# EAGLE design top (EAGLE 9.6.2)
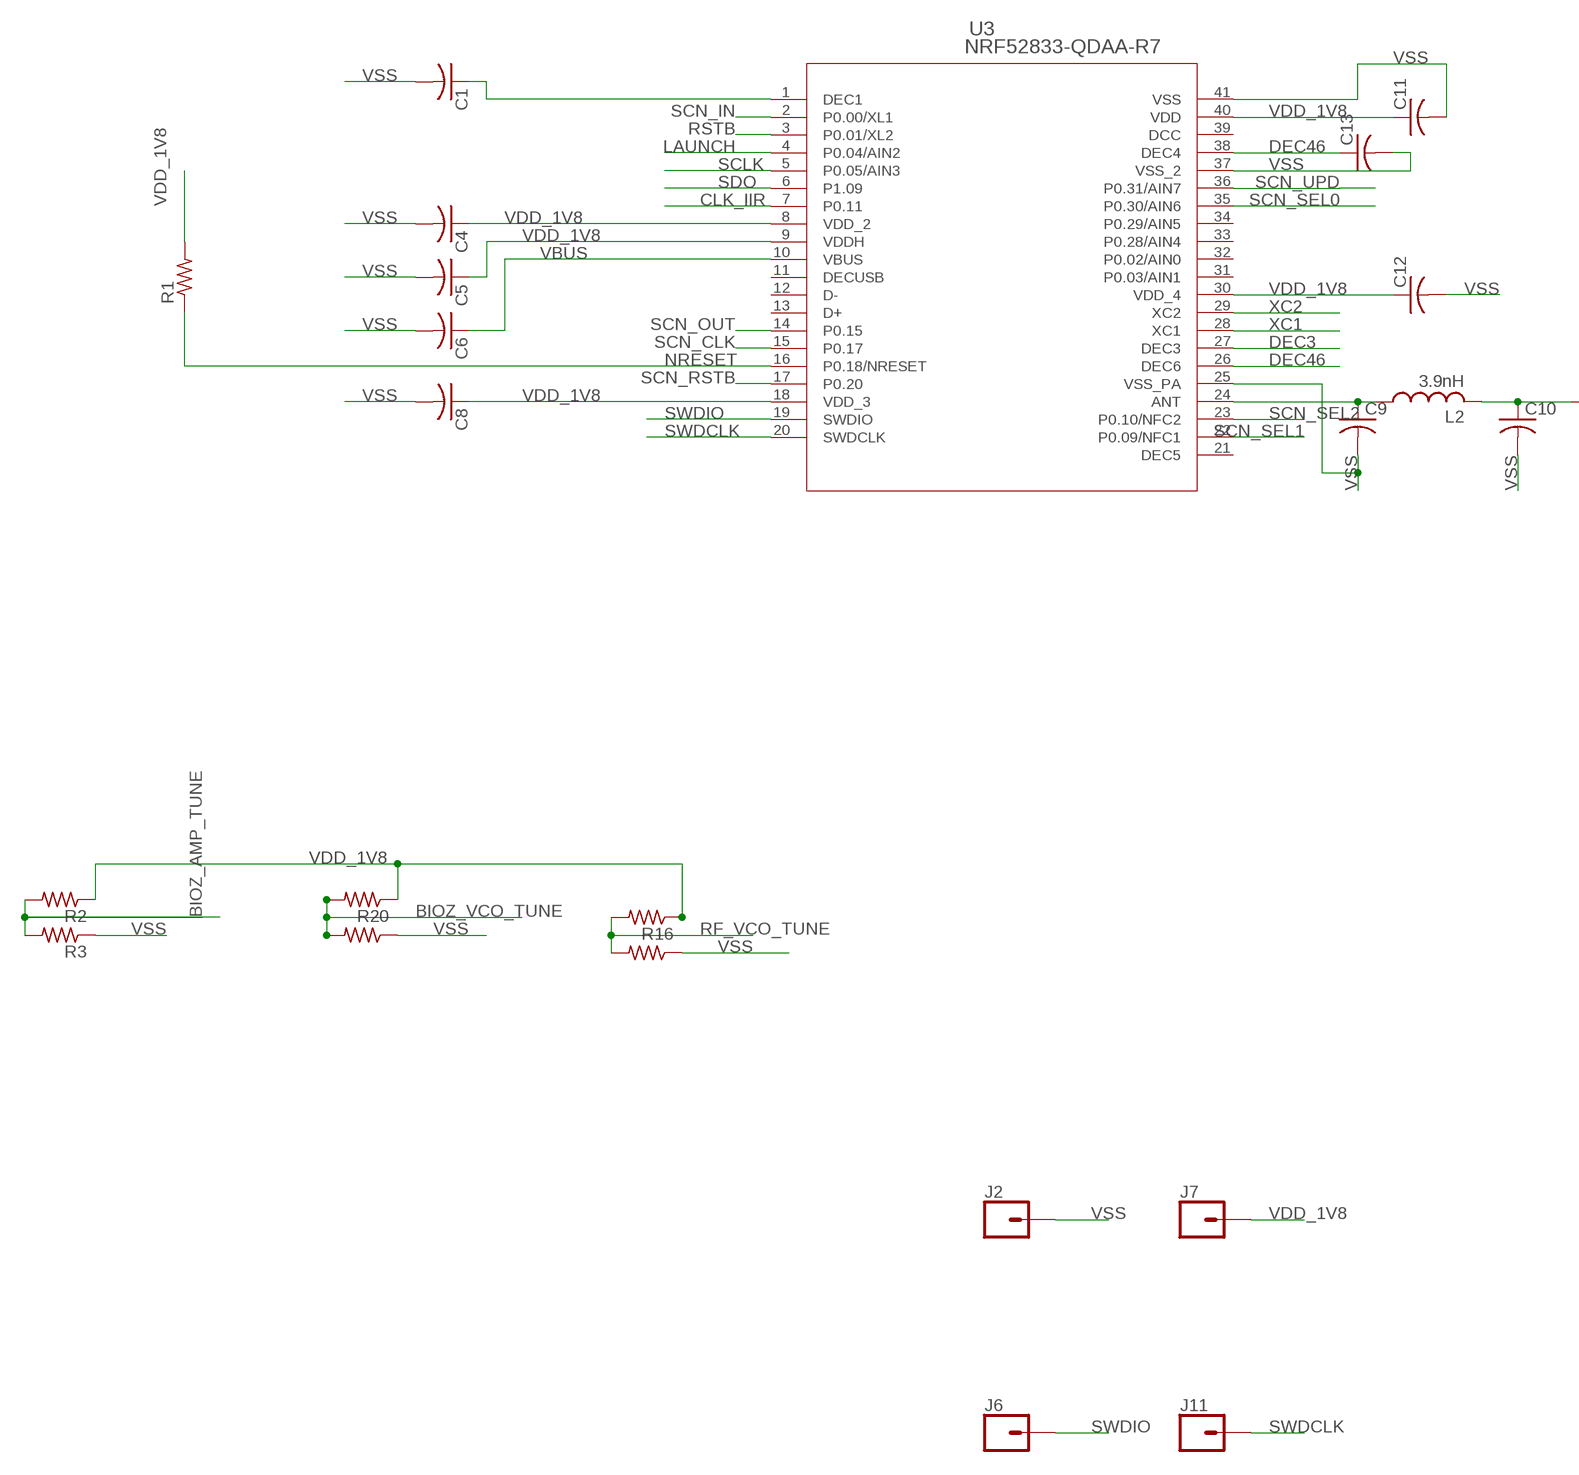
[diagram p0: schematic, sheet 1, part 1 of 2]
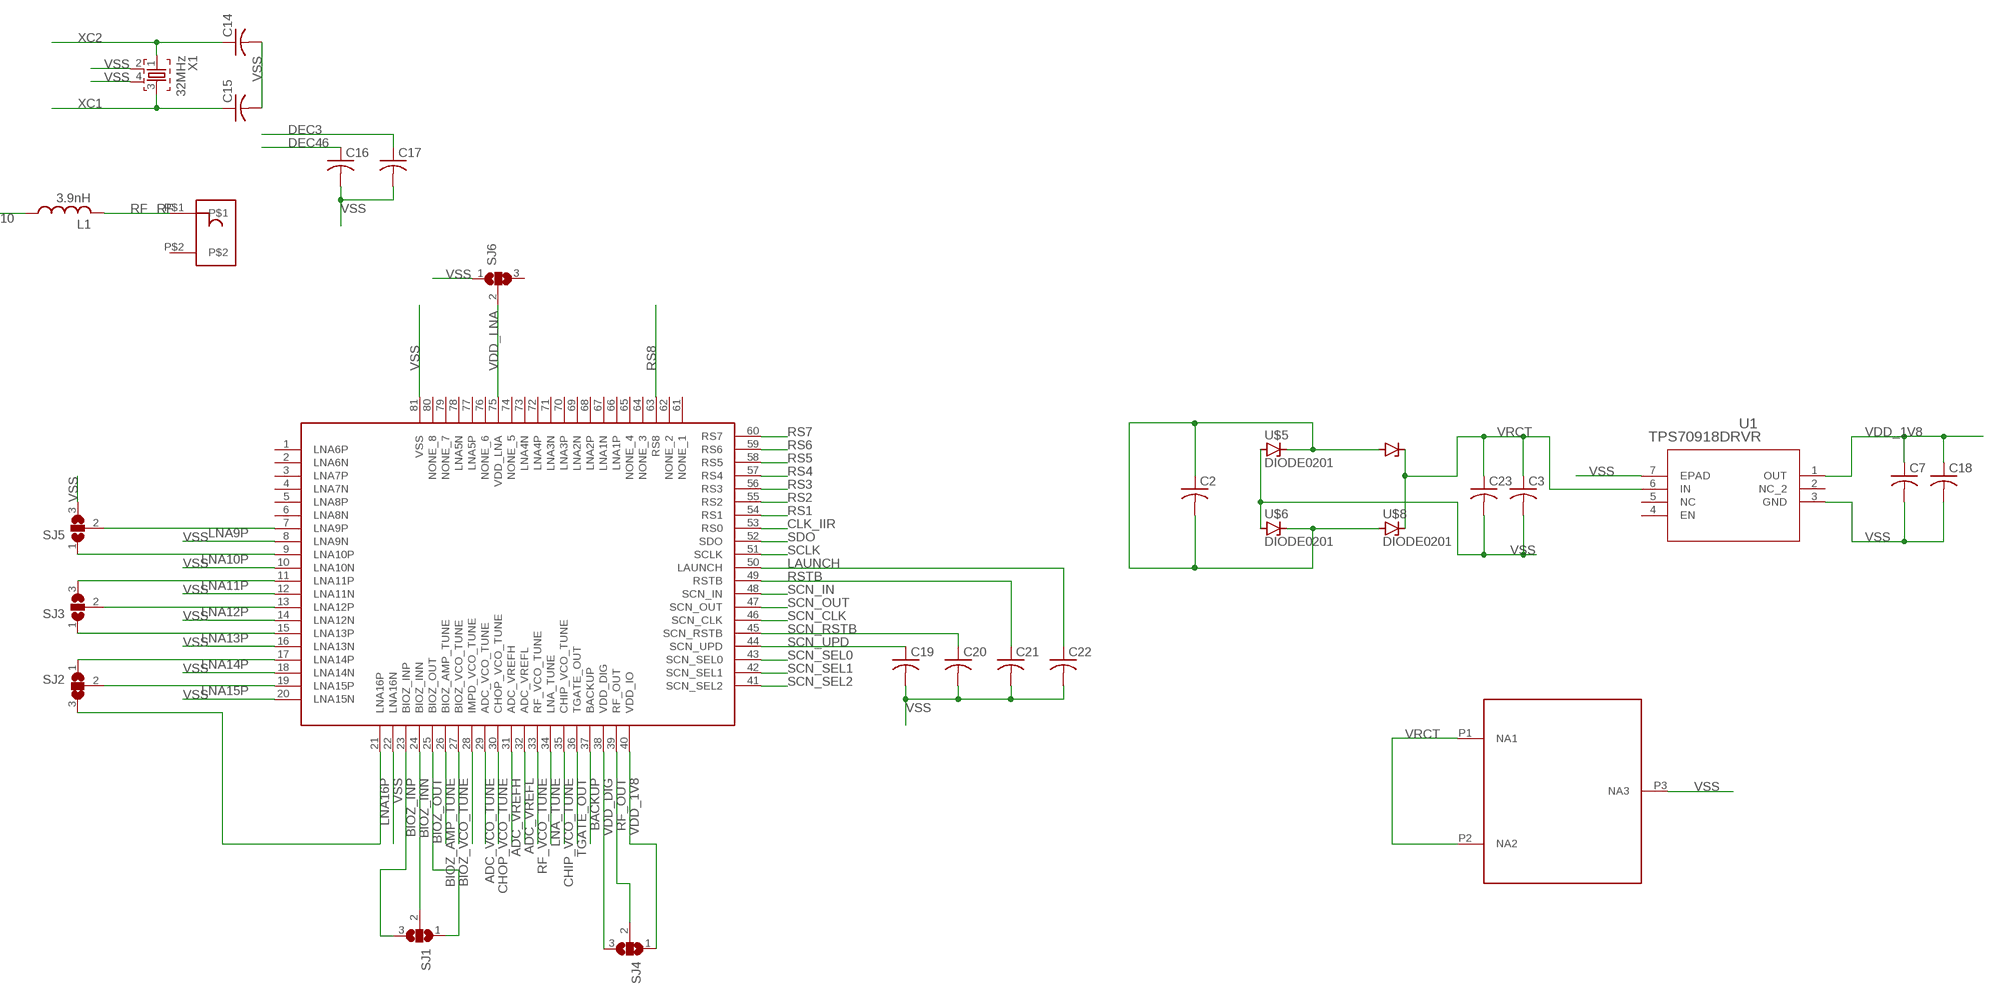
[diagram p1: schematic, sheet 1, part 2 of 2]

## Parts
C1  C-USC0201  [C0201]
C2  C-USC0201  [C0201]
C3  C-USC0402  [C0402]
C4  C-USC0201  [C0201]
C5  C-USC0201  [C0201]
C6  C-USC0201  [C0201]
C7  C-USC1210  [C1210]
C8  C-USC0201  [C0201]
C9  C-USC0201  [C0201]
C10  C-USC0201  [C0201]
C11  C-USC0201  [C0201]
C12  C-USC0201  [C0201]
C13  C-USC0201  [C0201]
C14  C-USC0201  [C0201]
C15  C-USC0201  [C0201]
C16  C-USC0201  [C0201]
C17  C-USC0201  [C0201]
C18  C-USC0402  [C0402]
C19  C-USC0201  [C0201]
C20  C-USC0201  [C0201]
C21  C-USC0201  [C0201]
C22  C-USC0201  [C0201]
C23  C-USC1210  [C1210]
J2  CONN_01  [1X01]
J6  CONN_01  [1X01]
J7  CONN_01  [1X01]
J11  CONN_01  [1X01]
L1  3.9nH  INDUCTOR_0402_N  [RESC0402_N]
L2  3.9nH  INDUCTOR_0402_N  [RESC0402_N]
R1  R-US_R0402  [R0402]
R2  R-US_R0201  [R0201]
R3  R-US_R0201  [R0201]
R16  R-US_R0201  [R0201]
R17  R-US_R0201  [R0201]
R20  R-US_R0201  [R0201]
R22  R-US_R0201  [R0201]
SJ1  SJ2W  [SJ_2]
SJ2  SJ2W  [SJ_2]
SJ3  SJ2W  [SJ_2]
SJ4  SJ2W  [SJ_2]
SJ5  SJ2W  [SJ_2]
SJ6  SJ2W  [SJ_2]
U1  TPS70918DRVR  [DRV6_1P6X1_TEX]
U3  NRF52833-QDAA-R7  [QFN40_5X5_DQ_NOR]
U$1  CHIP_QFN  [QFN50P1200X1200X80-81T900N]
U$3  3030TR  [3030TR]
U$4  AMCA31  [AMCA31]
U$5  DIODE0201  [C0201]
U$6  DIODE0201  [C0201]
U$7  DIODE0201  [C0201]
U$8  DIODE0201  [C0201]
X1  32MHz  XTAL_32MHZ  [BT-XTAL_2016_N]

## Nets
ADC_VCO_TUNE: U$1.29(ADC_VCO_TUNE)
ADC_VREFH: U$1.31(ADC_VREFH)
ADC_VREFL: U$1.32(ADC_VREFL)
BACKUP: U$1.37(BACKUP)
BIOZ_AMP_TUNE: R2.2 R3.2 U$1.26(BIOZ_AMP_TUNE)
BIOZ_INN: SJ1.2 U$1.24(BIOZ_INN)
BIOZ_INP: SJ1.3 U$1.23(BIOZ_INP)
BIOZ_OUT: SJ1.1 U$1.25(BIOZ_OUT)
BIOZ_VCO_TUNE: R20.2 R22.2 U$1.27(BIOZ_VCO_TUNE)
CHIP_VCO_TUNE: U$1.35(CHIP_VCO_TUNE)
CHOP_VCO_TUNE: U$1.30(CHOP_VCO_TUNE)
CLK_IIR: U3.7(P0.11) U$1.53(RS0)
DEC3: C17.1 U3.27(DEC3)
DEC46: C13.1 C16.1 U3.26(DEC6) U3.38(DEC4)
LAUNCH: C22.1 U3.4(P0.04/AIN2) U$1.50(LAUNCH)
LNA9P: SJ5.2 U$1.7(LNA9P)
LNA10P: SJ5.1 U$1.9(LNA10P)
LNA11P: SJ3.3 U$1.11(LNA11P)
LNA12P: SJ3.2 U$1.13(LNA12P)
LNA13P: SJ3.1 U$1.15(LNA13P)
LNA14P: SJ2.1 U$1.17(LNA14P)
LNA15P: SJ2.2 U$1.19(LNA15P)
LNA16P: SJ2.3 U$1.21(LNA16P)
LNA_TUNE: U$1.34(LNA_TUNE)
N$2: C1.1 U3.1(DEC1)
N$3: U$1.28(IMPD_VCO_TUNE)
N$4: C9.1 L2.1 U3.24(ANT)
N$5: C10.1 L1.1 L2.2
N$7: C2.1 C2.2 U$5.2(C) U$6.2(C) U$7.1(A) U$8.1(A)
NRESET: R1.1 U3.16(P0.18/NRESET)
RF: L1.2 U$4.P$1
RF_OUT: SJ4.2 U$1.39(RF_OUT)
RF_VCO_TUNE: R16.2 R17.2 U$1.33(RF_VCO_TUNE)
RS1: U$1.54(RS1)
RS2: U$1.55(RS2)
RS3: U$1.56(RS3)
RS4: U$1.57(RS4)
RS5: U$1.58(RS5)
RS6: U$1.59(RS6)
RS7: U$1.60(RS7)
RS8: U$1.63(RS8)
RSTB: C21.1 U3.3(P0.01/XL2) U$1.49(RSTB)
SCLK: U3.5(P0.05/AIN3) U$1.51(SCLK)
SCN_CLK: U3.15(P0.17) U$1.46(SCN_CLK)
SCN_IN: U3.2(P0.00/XL1) U$1.48(SCN_IN)
SCN_OUT: U3.14(P0.15) U$1.47(SCN_OUT)
SCN_RSTB: C20.1 U3.17(P0.20) U$1.45(SCN_RSTB)
SCN_SEL0: U3.35(P0.30/AIN6) U$1.43(SCN_SEL0)
SCN_SEL1: U3.22(P0.09/NFC1) U$1.42(SCN_SEL1)
SCN_SEL2: U3.23(P0.10/NFC2) U$1.41(SCN_SEL2)
SCN_UPD: C19.1 U3.36(P0.31/AIN7) U$1.44(SCN_UPD)
SDO: U3.6(P1.09) U$1.52(SDO)
SWDCLK: J11.1 U3.20(SWDCLK)
SWDIO: J6.1 U3.19(SWDIO)
TGATE_OUT: U$1.36(TGATE_OUT)
VBUS: C6.1 U3.10(VBUS)
VDD_1V8: C4.1 C5.1 C7.1 C8.1 C11.1 C12.1 C18.1 J7.1 R1.2 R2.1 R16.1 R20.1 SJ4.1 U1.1(OUT) U3.8(VDD_2) U3.9(VDDH) U3.18(VDD_3) U3.30(VDD_4) U3.40(VDD) U$1.40(VDD_IO)
VDD_DIG: SJ4.3 U$1.38(VDD_DIG)
VDD_LNA: SJ6.2 U$1.75(VDD_LNA)
VRCT: C3.1 C23.1 U1.6(IN) U$3.P1(NA1) U$3.P2(NA2) U$7.2(C) U$8.2(C)
VSS: C1.2 C3.2 C4.2 C5.2 C6.2 C7.2 C8.2 C9.2 C10.2 C11.2 C12.2 C13.2 C14.2 C15.2 C16.2 C17.2 C18.2 C19.2 C20.2 C21.2 C22.2 C23.2 J2.1 R3.1 R17.1 R22.1 SJ5.3 SJ6.1 U1.3(GND) U1.7(EPAD) U3.25(VSS_PA) U3.37(VSS_2) U3.41(VSS) U$1.8(LNA9N) U$1.10(LNA10N) U$1.12(LNA11N) U$1.14(LNA12N) U$1.16(LNA13N) U$1.18(LNA14N) U$1.20(LNA15N) U$1.22(LNA16N) U$1.81(VSS) U$3.P3(NA3) U$5.1(A) U$6.1(A) X1.2 X1.4
XC1: C15.1 U3.28(XC1) X1.3
XC2: C14.1 U3.29(XC2) X1.1
Unconnected: SJ6.3 U1.2(NC_2) U1.4(EN) U1.5(NC) U3.12(D-) U3.13(D+) U3.31(P0.03/AIN1) U3.32(P0.02/AIN0) U3.33(P0.28/AIN4) U3.34(P0.29/AIN5) U$1.1(LNA6P) U$1.2(LNA6N) U$1.3(LNA7P) U$1.4(LNA7N) U$1.5(LNA8P) U$1.6(LNA8N) U$1.61(NONE_1) U$1.62(NONE_2) U$1.64(NONE_3) U$1.65(NONE_4) U$1.66(LNA1P) U$1.67(LNA1N) U$1.68(LNA2P) U$1.69(LNA2N) U$1.70(LNA3P) U$1.71(LNA3N) U$1.72(LNA4P) U$1.73(LNA4N) U$1.74(NONE_5) U$1.76(NONE_6) U$1.77(LNA5P) U$1.78(LNA5N) U$1.79(NONE_7) U$1.80(NONE_8) U$4.P$2

## Power pins joined to a net without a drawn wire
DCC: U3.39(DCC)
DEC5: U3.21(DEC5)
DECUSB: U3.11(DECUSB)

## Library data of the parts
C1-C23 = rcl:C-US: CAPACITOR, American symbol; SPICEPREFIX: C
J2 J6 J7 J11 = SparkFun-Connectors (1):CONN_01: Single connection point. Often used as Generic Header-pin footprint for 0.1 inch spaced/style header connections On any of the 0.1 inch spaced packages, you can populate with these: Break Away Headers - Straight <https://www.sparkfun.com/products/116> (PRT-00116) Break Away Male Headers - Right Angle <https://www.sparkfun.com/products/553> (PRT-00553) Female Headers <https://www.sparkfun.com/products/115> (PRT-00115) Break Away Headers - Machine Pin <https://www.sparkfun.com/products/117> (PRT-00117) Break Away Female Headers - Swiss Machine Pin <https://www.sparkfun.com/products/743> (PRT-00743) This device is also useful as a general connection point to wire up your design to another part of your project. Our various solder wires solder well into these plated through hole pads. Hook-Up Wire - Assortment (Stranded, 22 AWG) <https://www.sparkfun.com/products/11375> (PRT-11375) Hook-Up Wire - Assortment (Solid Core, 22 AWG) <https://www.sparkfun.com/products/11367> (PRT-11367) View the entire wire category on our website here <https://www.sparkfun.com/categories/141> Special notes: SMTSO-256-ET is a "flush mount" nut for a 4-40 screw. We mostly use this on specialty testbeds; it is a nice way to connect hardware to your PCB at an adjustable hieght. Also note, the SNAP packages are for using a snappable style connector. We sell a baggie of snaps and they are also used on two LilyPad designs: Snap Assortment - 30 pack (male and female) <https://www.sparkfun.com/products/11347> (DEV-11347) LilyPad Arduino SimpleSnap <https://www.sparkfun.com/products/10941> (DEV-10941) LilyPad SimpleSnap Protoboard <https://www.sparkfun.com/products/10940> (DEV-10940)
L1 L2 = Nordic_nRF:INDUCTOR: Generic chip inductor
R1-R3 R16 R17 R20 R22 = rcl:R-US_: RESISTOR, American symbol; SPICEPREFIX: R
SJ1-SJ6 = jumper:SJ2W: SMD solder JUMPER
U1 = VLSI_qfn56:TPS70918DRVR; COPYRIGHT: Copyright (C) 2023 Ultra Librarian. All rights reserved.; MANUFACTURER_PART_NUMBER: TPS70918DRVR; MFR_NAME: Texas Instruments
U3 = Nordic_nRF:NRF52833-QDAA-R7; COPYRIGHT: Copyright (C) 2023 Ultra Librarian. All rights reserved.; MANUFACTURER_PART_NUMBER: NRF52833-QDAA-R7; MFR_NAME: Nordic Semiconductor
U$1 = Charlie:CHIP_QFN
U$3 = VLSI_qfn56:3030TR
U$4 = VLSI_qfn56:AMCA31
U$5-U$8 = VLSI_qfn56:DIODE0201
X1 = Nordic_nRF:XTAL_32MHZ

## Board
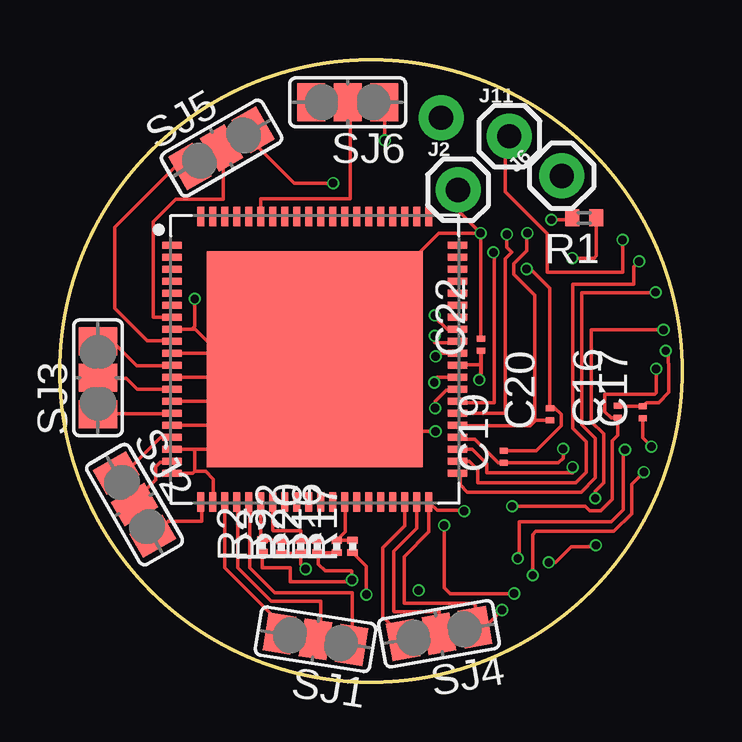
[diagram p2: board, top side]
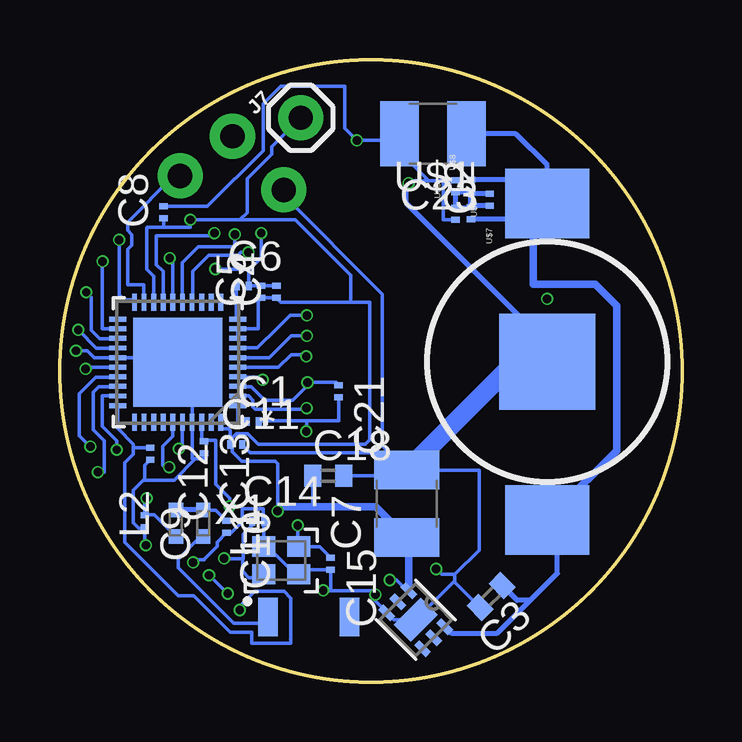
[diagram p3: board, bottom side, seen from below]

Size 25.91 x 25.91 mm. Coordinates in mm from the lower left corner, seen from the top.
Outline: circle at 12.95,12.95 radius 12.95
Copper layers (1*16): Top 0.035mm / dielectric 1.6mm / Bottom 0.035mm
Design rules "jlcpcb-2layers *": minimum track width 5mil, minimum drill 0.3mm, track to track 8mil, track to pad 8mil, pad to pad 0.19mm, via to via 8mil, smd to smd 8mil, copper to edge 0.3mm, drill to drill 0.5mm, minimum pad ring 10mil, minimum via ring 3mil, stop-mask expansion 4mil, vias tented up to drill 0mil, thermal gap 10mil

### Footprints (pad centres in the part's own frame; a part is rotated, then mirrored left to right if it is on the bottom)
C0201 = smd 0.25 x 0.35: 1 -0.25,0; 2 0.25,0
C0402 = smd 0.7 x 0.9: 1 -0.65,0; 2 0.65,0
C1210 = smd 1.6 x 2.7: 1 -1.4,0; 2 1.4,0
1X01 = drill 1.016 pad 1.88: 1 0,0
RESC0402_N = smd 0.6 x 0.6: 1 -0.55,0; 2 0.55,0
R0402 = smd 0.6 x 0.7: 1 -0.5,0; 2 0.5,0
R0201 = smd 0.28 x 0.43: 1 -0.255,0; 2 0.255,0
SJ_2 = smd 1.168 x 1.6: 1 -1.524,0; 2 0,0; 3 1.524,0
DRV6_1P6X1_TEX = smd 0.7 x 0.3: 1 -1.05,0.65; 2 -1.05,0; 3 -1.05,-0.65; 4 1.05,-0.65; 5 1.05,0; 6 1.05,0.65 | smd 1.016 x 1.6: 7 0,0
QFN40_5X5_DQ_NOR = smd 0.711 x 0.203: 1 -2.502,1.8; 2 -2.502,1.4; 3 -2.502,1; 4 -2.502,0.6; 5 -2.502,0.2; 6 -2.502,-0.2; 7 -2.502,-0.6; 8 -2.502,-1; 9 -2.502,-1.4; 10 -2.502,-1.8; 21 2.502,-1.8; 22 2.502,-1.4; 23 2.502,-1; 24 2.502,-0.6; 25 2.502,-0.2; 26 2.502,0.2; 27 2.502,0.6; 28 2.502,1; 29 2.502,1.4; 30 2.502,1.8 | smd 0.203 x 0.711: 11 -1.8,-2.502; 12 -1.4,-2.502; 13 -1,-2.502; 14 -0.6,-2.502; 15 -0.2,-2.502; 16 0.2,-2.502; 17 0.6,-2.502; 18 1,-2.502; 19 1.4,-2.502; 20 1.8,-2.502; 31 1.8,2.502; 32 1.4,2.502; 33 1,2.502; 34 0.6,2.502; 35 0.2,2.502; 36 -0.2,2.502; 37 -0.6,2.502; 38 -1,2.502; 39 -1.4,2.502; 40 -1.8,2.502 | smd 3.708 x 3.708: 41 0,0
QFN50P1200X1200X80-81T900N = smd 0.812 x 0.282: 1 -5.95,4.75; 2 -5.95,4.25; 3 -5.95,3.75; 4 -5.95,3.25; 5 -5.95,2.75; 6 -5.95,2.25; 7 -5.95,1.75; 8 -5.95,1.25; 9 -5.95,0.75; 10 -5.95,0.25; 11 -5.95,-0.25; 12 -5.95,-0.75; 13 -5.95,-1.25; 14 -5.95,-1.75; 15 -5.95,-2.25; 16 -5.95,-2.75; 17 -5.95,-3.25; 18 -5.95,-3.75; 19 -5.95,-4.25; 20 -5.95,-4.75; 41 5.95,-4.75; 42 5.95,-4.25; 43 5.95,-3.75; 44 5.95,-3.25; 45 5.95,-2.75; 46 5.95,-2.25; 47 5.95,-1.75; 48 5.95,-1.25; 49 5.95,-0.75; 50 5.95,-0.25; 51 5.95,0.25; 52 5.95,0.75; 53 5.95,1.25; 54 5.95,1.75; 55 5.95,2.25; 56 5.95,2.75; 57 5.95,3.25; 58 5.95,3.75; 59 5.95,4.25; 60 5.95,4.75 | smd 0.282 x 0.812: 21 -4.75,-5.95; 22 -4.25,-5.95; 23 -3.75,-5.95; 24 -3.25,-5.95; 25 -2.75,-5.95; 26 -2.25,-5.95; 27 -1.75,-5.95; 28 -1.25,-5.95; 29 -0.75,-5.95; 30 -0.25,-5.95; 31 0.25,-5.95; 32 0.75,-5.95; 33 1.25,-5.95; 34 1.75,-5.95; 35 2.25,-5.95; 36 2.75,-5.95; 37 3.25,-5.95; 38 3.75,-5.95; 39 4.25,-5.95; 40 4.75,-5.95; 61 4.75,5.95; 62 4.25,5.95; 63 3.75,5.95; 64 3.25,5.95; 65 2.75,5.95; 66 2.25,5.95; 67 1.75,5.95; 68 1.25,5.95; 69 0.75,5.95; 70 0.25,5.95; 71 -0.25,5.95; 72 -0.75,5.95; 73 -1.25,5.95; 74 -1.75,5.95; 75 -2.25,5.95; 76 -2.75,5.95; 77 -3.25,5.95; 78 -3.75,5.95; 79 -4.25,5.95; 80 -4.75,5.95 | smd 9 x 9: 81 0,0
3030TR = smd 2.9 x 3.5: P1 -6.6,0; P2 6.6,0 | smd 4 x 4: P3 0,0
AMCA31 = smd 0.8 x 1.6: P$1 3.4,0; P$2 0,0
BT-XTAL_2016_N = smd 0.95 x 0.85: 1 -0.725,-0.575; 2 0.725,-0.575; 3 0.725,0.575; 4 -0.725,0.575

### Placement (x,y rotation side)
C1  17.88,10.85 0 bottom
C2  8,20.09 90 bottom
C3  7.94,3.55 225 bottom
C4  16.89,16.26 90 bottom
C5  17.53,16.26 90 bottom
C6  18.29,16.48 0 bottom
C7  11.46,7.42 90 bottom
C8  21.59,19.56 90 bottom
C9  22.38,6.68 270 bottom
C10  18.97,6.45 270 bottom
C11  18.57,9.88 0 bottom
C12  22.15,9.5 270 bottom
C13  19.91,9.78 270 bottom
C14  17.65,6.68 0 bottom
C15  14.63,4.93 270 bottom
C16  23.24,11.25 90 top
C17  24.28,11.23 90 top
C18  14.73,8.59 0 bottom
C19  18.49,9.37 90 top
C20  20.42,11.15 90 top
C21  14.3,12.12 270 bottom
C22  17.54,14.05 90 top
C23  10.36,22.83 180 bottom
J2  16.59,20.5 0 top
J6  20.9,21.08 45 top
J7  15.88,23.5 45 bottom
J11  18.72,22.73 0 top
L1  19.94,6.6 270 bottom
L2  21.08,6.6 90 bottom
R1  21.84,19.33 180 top
R2  8.43,5.66 90 top
R3  9.22,5.61 90 top
R16  11.53,5.64 90 top
R17  12.19,5.64 90 top
R20  10.72,5.64 90 top
R22  10.03,5.64 90 top
SJ1  10.65,1.77 171 top
SJ2  3.11,7.38 300 top
SJ3  1.58,12.67 90 top
SJ4  15.79,2.01 190 top
SJ5  6.73,22.24 30 top
SJ6  11.98,24.15 180 top
U1  11.09,2.59 315 bottom
U3  21.01,13.31 180 bottom
U$1  10.62,13.44 0 top
U$3  5.61,13.34 270 bottom
U$4  13.84,2.69 180 bottom
U$5  9.42,19.51 90 bottom
U$6  9.42,20.65 270 bottom
U$7  8.79,19.53 270 bottom
U$8  8.79,20.68 90 bottom
X1  16.69,5.05 0 bottom

### Tracks (layer width: path | path; a pad name or v marks a point on that pad's centre or on a via)
BIOZ_AMP_TUNE
  Top 0.152: 8.44,7.41 U$1.26 8.37,5.99 R2.2 | R2.2 8.6,5.92 | R2.2 8.46,5.89 9.2,5.89 R3.2
BIOZ_INN
  Top 0.152: SJ1.2 10.86,1.99 10.86,3.36 8.8,3.36 7.4,4.76 7.4,7.46 U$1.24
BIOZ_INP
  Top 0.152: U$1.23 6.87,4.76 9.14,2.49 SJ1.3
BIOZ_OUT
  Top 0.152: U$1.25 7.92,7.44 7.92,4.75 8.95,3.71 12.17,3.71 12.17,1.56 SJ1.1
BIOZ_VCO_TUNE
  Top 0.152: R20.2 R22.2 10.03,6.29 8.89,6.29 8.87,6.31 U$1.27
CLK_IIR  (via drill 0.35)
  Top 0.152: U$1.53 16.12,14.69 15.62,15.19 v15.62,15.27
  Bottom 0.152: U3.7 17.68,13.91 16.87,14.72 16.87,14.73 16.32,15.28 15.63,15.28 v15.62,15.27
DEC3  (via drill 0.35)
  Top 0.152: v24.64,9.8 24.28,10.16 C17.1
  Bottom 0.152: U3.27 23.53,12.69 24.42,12.69 25.1,12.01 25.1,10.26 v24.64,9.8
DEC46  (via drill 0.35)
  Top 0.152: v18.85,7.32 19.13,7.32 19.12,7.32 v18.84,7.32 21.88,7.32 22.08,7.12 22.52,7.12 23.01,7.61 23.01,10.04 23.05,10.07 23.24,10.27 C16.1 22.96,11 22.71,11.25 22.71,11.99 24.79,11.99 24.84,12.04 v24.84,13.04 24.81,13.07
  Bottom 0.152: U3.38 20.01,10.07 19.96,10.07 C13.1 19.88,10.06 19.43,10.06 19.43,8.22 18.84,7.64 v18.84,7.32 18.84,7.53 | v24.84,13.04 24.89,13.04 24.82,13.11 U3.26
LAUNCH  (via drill 0.35)
  Top 0.152: U$1.50 16.67,13.19 16.69,13.21 17.55,13.21 17.55,13.79 C22.1 17.54,12.65 v17.47,12.58 17.55,12.66 17.55,13.29
  Bottom 0.152: U3.4 18.48,12.69 17.58,12.69 v17.47,12.58
LNA9P
  Top 0.152: U$1.7 3.89,15.19 3.89,19.16 4.82,20.1 6.81,20.1 6.81,22.16 SJ5.2
LNA10P
  Top 0.152: 4.71,14.14 U$1.9 4.64,14.22 3.64,14.22 2.29,15.57 2.29,18.94 4.83,21.48 SJ5.1
LNA11P
  Top 0.152: 1.78,14.16 1.78,14.17 1.6,14.17 SJ3.3 | SJ3.3 2.17,14.19 3.19,13.16 4.64,13.16 U$1.11 | SJ3.3
LNA12P
  Top 0.152: SJ3.2 1.66,12.66 2.76,12.66 3.23,12.19 U$1.13
LNA13P
  Top 0.152: U$1.15 4.64,11.16 1.61,11.16 SJ3.1
LNA14P
  Top 0.152: 4.64,10.16 U$1.17 4.21,10.19 2.72,8.7 SJ2.1
LNA15P
  Top 0.152: 3.1,7.92 SJ2.2 3.1,7.55 3.98,8.43 3.98,8.97 4.17,9.16 4.64,9.16 U$1.19 4.3,9.19
LNA16P
  Top 0.152: SJ2.3 4.5,6.7 5.9,6.7 5.9,7.45 U$1.21
N$2
  Bottom 0.152: C1.1 18.5,10.85 U3.1
N$4  (via drill 0.35)
  Top 0.152: v25.15,14.66 22.14,14.66 22.14,10.84 22.65,10.33 22.65,8.29 22.3,7.94 v22.3,7.65
  Bottom 0.152: 22.38,6.96 22.38,7.55 22.3,7.62 v22.3,7.65 22.28,7.65 22.23,7.7 | 22.38,6.96 C9.1 | U3.24 24.39,13.9 v25.15,14.66 | v25.15,14.66 | 21.34,6.05 L2.1 21.99,6.96 22.38,6.96
N$5
  Bottom 0.152: L2.2 21.07,7.26 | C10.1 19.43,7.15 L2.2 | L1.1 19.99,7.21 21.03,7.21 L2.2
N$7
  Bottom 0.203: U$7.1 8.81,19.76 U$5.2 U$6.2 8.81,20.4 U$8.1 | U$7.1 U$8.1 | C2.2 8.71,20.35 U$8.1 | C2.1 8.73,19.84 U$7.1
NRESET  (via drill 0.35)
  Top 0.152: v21.34,17.65 22.25,17.65 22.34,17.75 R1.1
  Bottom 0.152: v21.34,17.65 21.21,17.52 U3.16
RF
  Bottom 0.152: L1.2 20.04,6.05 20.98,5.11 20.98,4.76 18.66,2.44 17.45,2.44 17.24,2.64 U$4.P$1
RF_OUT
  Top 0.152: SJ4.2 15.79,2.92 13.92,2.92 13.9,2.94 13.9,5.43 14.87,6.39 U$1.39
RF_VCO_TUNE
  Top 0.152: R17.2 R16.2 11.89,6.25 11.89,7.46 U$1.33
RSTB  (via drill 0.35)
  Top 0.152: v15.6,12.47 15.6,12.56 15.72,12.69 U$1.49
  Bottom 0.152: v15.6,12.47 14.41,12.47 C21.1 | 15.66,12.36 15.6,12.42 v15.6,12.47 | v15.6,12.47 15.6,12.34 16.21,11.73 17.37,11.73 17.93,12.29 18.48,12.29 U3.3
SCLK  (via drill 0.35)
  Top 0.152: 16.21,13.69 U$1.51 15.65,13.69 v15.65,13.56
  Bottom 0.152: U3.5 16.8,13.11 16.28,13.63 15.72,13.63 v15.65,13.56
SCN_CLK  (via drill 0.35)
  Top 0.152: 16.51,11.24 U$1.46 18.55,11.19 18.55,17.62 18.83,17.89 18.62,18.11 v18.62,18.64
  Bottom 0.152: 18.54,18.56 v18.62,18.64 18.62,18.16 18.64,18.14 20.14,18.14 20.81,17.46 U3.15
SCN_IN  (via drill 0.35)
  Top 0.152: U$1.48 | U$1.48 16.62,12.14 | U$1.48 16.54,12.16 16.1,12.16 15.63,11.69 v15.63,11.4
  Bottom 0.152: v15.63,11.4 15.68,11.35 17.76,11.35 17.87,11.46 17.87,11.73 18.05,11.91 U3.2
SCN_OUT  (via drill 0.35)
  Top 0.152: U$1.47 16.62,11.63 18.08,11.63 18.1,11.62 18.1,17.86 v18.06,17.89
  Bottom 0.152: U3.14 20.39,15.83 20.39,17.1 19.71,17.78 18.49,17.78 18.38,17.89 v18.06,17.89
SCN_RSTB  (via drill 0.35)
  Top 0.152: 19.36,18.58 v19.48,18.69 19.45,18.67 19.45,17.96 18.91,17.42 18.91,16.98 19.79,16.1 19.79,10.9 | 16.61,10.64 U$1.45 16.59,10.66 19.6,10.66 19.79,10.85 19.79,10.9 | C20.1 19.79,10.9
  Bottom 0.152: v19.48,18.69 19.57,18.59 21.89,18.59 21.89,17.39 21.61,17.1 U3.17
SCN_SEL0  (via drill 0.35)
  Top 0.152: U$1.43 17.18,9.69 17.78,9.08 17.78,8.72 21.36,8.72 v21.36,8.95
  Bottom 0.152: U3.35 21.21,10.22 21.62,9.81 21.62,9.01 21.55,8.95 v21.36,8.95
SCN_SEL1  (via drill 0.35)
  Top 0.152: v24.13,17.52 23.9,17.29 23.9,16.56 21.36,16.56 21.36,10.56 21.92,10 21.92,8.72 21.48,8.29 17.4,8.29 17.4,8.84 17.05,9.19 U$1.42
  Bottom 0.152: v24.13,17.52 24.16,17.49 24.16,14.71 U3.22
SCN_SEL2  (via drill 0.35)
  Top 0.152: U$1.41 16.67,8.59 16.67,8.2 16.97,7.91 21.71,7.91 22.3,8.49 22.3,10.15 21.75,10.7 21.75,16.2 24.82,16.2 v24.82,16.23
  Bottom 0.152: v24.82,16.23 24.61,16.03 24.61,14.66 24.26,14.3 U3.23
SCN_UPD  (via drill 0.35)
  Top 0.152: 20.81,9.7 v20.96,9.7 20.96,9.32 20.76,9.12 C19.1 18.27,9.12 17.28,10.11 16.65,10.11 U$1.44
  Bottom 0.152: v20.96,9.7 20.81,9.86 U3.36
SDO  (via drill 0.35)
  Top 0.152: 16.59,14.16 U$1.52 16.52,14.14 15.62,14.14 v15.62,14.41
  Bottom 0.152: U3.6 | U3.6 17.19,13.51 16.28,14.41 v15.62,14.41 | U3.6 18.09,13.51
SWDCLK  (via drill 0.35)
  Top 0.152: v23.44,18.41 23.44,17.07 20.3,17.07 20.3,18.67 18.54,20.42 18.54,22.73 J11.1
  Bottom 0.152: 22.86,15.86 U3.20 22.92,15.92 23.24,15.92 23.44,16.13 v23.44,18.41
SWDIO
  Bottom 0.152: 21.03,21.08 J6.1 21.16,21.08 23.09,19.15 23.09,18.81 22.91,18.64 22.91,18.2 23.09,18.02 23.09,16.55 22.43,16.55 22.43,15.83 U3.19
VBUS
  Bottom 0.152: U3.10 18.56,15.17 18.56,16.46 C6.1
VDD_1V8  (via drill 0.35)
  Top 0.152: 12.04,4.24 v12.17,4.24 | R1.2 21.27,19.25 v20.47,19.25 | R16.1 R20.1 10.77,5.38 10.77,4.9 11.05,4.62 12.14,4.62 12.17,4.6 v12.17,4.24 | v12.17,4.24 12.09,4.17 9.6,4.17 9.6,4.75 8.43,4.75 R2.1 | v18.42,2.99 v18.42,2.98 17.7,2.27 SJ4.1 17.29,3.19 17.2,3.28 14.33,3.28 14.33,5.22 15.37,6.25 U$1.40 15.72,7.14 16.82,7.14 v16.84,7.11
  Bottom 0.152: U3.8 U3.9 17.65,14.71 17.65,16.01 C4.1 | 18.41,19.25 16.1,19.25 13.8,16.95 13.8,15.82 | 23.54,11.47 U3.30 23.51,10.55 22.86,9.91 22.86,9.75 | C4.1 | 21.59,18.95 20.47,18.95 v20.47,19.25 18.41,19.25 | 21.59,18.95 22.27,18.95 22.3,18.92 22.3,17.2 22.01,16.9 U3.18 | 21.59,18.95 C8.1 | C7.1 11.53,6.09 11.56,6.09 12.73,7.26 | v12.17,4.24 11.89,4.24 11.43,3.79 U1.1 | 18.41,19.25 18.11,19.55 18.11,20.96 17.09,21.98 17.09,22.29 J7.1 | 22.86,9.75 22.86,9.48 23.21,9.12 23.22,9.12 23.22,5.82 20.98,3.58 20.34,3.58 18.81,2.06 17.92,2.06 17.92,1.6 16.3,1.6 16.28,1.62 16.28,3.48 16.57,3.77 17.79,3.77 18.42,3.14 v18.42,2.99 | 16.84,7.14 v16.84,7.11 16.84,9.09 16.94,9.2 18.33,9.2 18.72,9.59 18.72,9.79 C11.1 | 15.29,7.29 15.38,7.38 C18.1 | U3.40 19.21,10.54 18.9,10.54 18.82,10.46 C11.1 | C4.1 C5.1 | C12.1 22.86,9.75 | C4.1 16.71,15.82 13.8,15.82 | 13.8,15.82 13.01,15.82 13.01,10.08 13.18,9.91 17.65,9.91 17.91,10.17 18.08,10.34 18.56,10.34 18.72,10.17 18.72,9.98 C11.1
  Bottom 0.203: 11.37,5.93 C7.1
  Bottom 0.305: U1.1 11.37,5.93 11.53,6.09 | C7.1 11.48,6.02 12.73,7.26 12.75,7.29 15.29,7.29 16.66,7.29 v16.84,7.11
VDD_DIG
  Top 0.152: SJ4.3 14.29,1.87 13.46,2.7 13.46,5.58 14.37,6.5 U$1.38
VDD_LNA
  Top 0.152: SJ6.2 12.09,24.05 12.09,20.12 8.37,20.12 U$1.75
VRCT
  Bottom 0.152: 4.46,6.2 5.54,6.2 | U$3.P2 5.23,7.11 5.23,7.54 | U$3.P1 6.27,19.28 | U$3.P1 6.6,20.93 | U$3.P1 5.61,19.86 | 5.18,4.52 5.18,7.17
  Bottom 0.203: U$3.P1 5.61,21.54 6.91,22.84 C23.1 | 6.31,3.39 7.68,2.02 9.61,2.02 U1.6 | 5.54,6.2 5.54,6.66 U$3.P2 | 6.6,20.93 U$8.2 | 6.27,19.28 U$7.2 | 6.31,3.39 5.18,4.52 5.18,7.49 5.23,7.54 | 6.31,3.39 6.86,3.39 C3.1
  Bottom 0.305: U$3.P2 5.18,7.17 2.72,9.63 2.72,15.67 3.61,16.56 6.2,16.56 6.2,19.35 U$3.P1
VSS  (via drill 0.35)
  Top 0.152: v13.54,22.55 13.54,24.12 SJ6.1 | v11.38,20.78 9.75,20.78 8.05,22.48 SJ5.3 | 8.87,13.69 U$1.10 4.64,13.66 | U$1.12 9.26,12.69 | U$1.14 8.26,11.69 | 8.26,11.69 9.14,12.57 | 9.14,12.57 9.26,12.69 | U$1.16 7.26,10.69 8.26,11.69 | 9.65,13.08 9.38,12.81 | 9.38,12.81 9.26,12.69 | U$1.81 10.57,13.49 15.77,18.69 v17.52,18.69 | v19.44,17.2 19.47,17.22 19.57,17.22 20.4,16.39 20.4,11.43 | 10.46,11.25 9.14,12.57 | U$1.22 6.39,7.51 6.39,8.44 6.07,8.76 5.61,8.76 | 4.9,8.69 U$1.20 5.54,8.69 5.61,8.76 | U$1.8 5.49,14.69 | 5.49,14.69 5.62,14.69 7.21,13.11 10.29,13.11 | 13.42,9.41 12.4,10.44 | 12.4,10.44 10.62,12.22 U$1.81 | v12.77,3.63 12.77,4.81 R17.1 | v10.24,4.7 10.03,4.9 R22.1 10.01,5.36 R3.1 | C17.2 23.27,11.48 C16.2 | U$1.18 5.61,9.69 | 5.61,9.69 6.87,9.69 9.99,12.81 | 25.37,13.66 25.35,13.69 | 25.35,13.69 v25.24,13.79 | C17.2 24.38,11.58 | 8.32,14.23 8.87,13.69 | 8.87,13.69 9.32,13.23 10.41,13.23 U$1.81 | C20.2 20.4,11.43 | v17.52,18.69 17.48,18.69 17.53,18.64 17.53,17.68 17.54,17.67 C22.2 | v15.65,10.44 12.4,10.44 | 20.4,11.43 20.59,11.43 20.88,11.14 20.88,10.66 19.84,9.62 C19.2 | C17.2 24.44,11.63 24.94,11.63 25.37,12.07 25.37,13.26 25.35,13.29 25.35,13.69 | 10.29,13.11 10.62,13.11 U$1.81 | 5.49,14.69 5.61,14.81 v5.61,15.95 | v22.33,5.69 22.26,5.62 21.3,5.62 20.66,4.98 v20.36,4.98 | 10.29,13.11 9.99,12.81 | 9.99,12.81 9.38,12.81 | U$1.81 10.29,13.11 | 5.61,8.76 5.61,9.69 | v17.52,18.69 16.59,19.63 J2.1
  Bottom 0.152: 20.66,12.46 20.16,12.97 20.5,13.31 U3.41 22.38,14.68 22.61,14.68 | C4.2 C5.2 17.95,16.51 17.98,16.48 C6.2 18.04,17.14 | C23.2 12.04,22.55 12.22,22.55 | 12.22,22.55 v13.54,22.55 14.04,23.06 14.04,24.82 16.71,24.82 17.45,24.09 17.45,22.13 19.76,19.81 20.61,19.81 C8.2 | U$6.1 9.45,20.88 9.93,20.88 | 9.93,20.88 10.54,20.88 | 10.54,20.88 12.22,22.55 | v11.38,20.78 11.46,20.7 11.46,19.91 | 12.24,2.82 12.01,2.59 11.9,2.59 | 11.9,2.59 U1.7 | U$3.P3 5.61,13.45 5.59,14.76 | 11.35,20.85 v11.38,20.78 | 18.04,17.14 18.04,17.2 v19.44,17.2 | C1.2 17.61,10.87 15.62,10.87 | 15.62,10.87 14.3,10.87 C21.2 | C11.2 17.99,9.55 12.19,9.55 11.57,8.93 C7.2 | 14.63,3.84 14.66,3.81 v14.94,3.81 14.94,3.79 14.55,3.79 | U$5.1 9.93,19.26 9.93,20.88 | v11.38,20.78 11.28,20.88 10.54,20.88 | U1.7 11.9,2.58 11.9,2.59 | U1.7 9.46,4.22 9.46,4.46 9.45,4.47 | U1.3 12.24,2.82 | 10.57,8.82 8.44,8.82 8.44,5.49 9.45,4.47 | 10.57,8.82 C7.2 | J2.1 16.59,20.27 12.47,16.15 12.47,9.83 C7.2 | 12.24,2.82 12.24,2.85 12.77,3.38 v12.77,3.63 12.92,3.79 14.55,3.79 | 9.45,4.47 10.01,4.47 v10.24,4.7 | C12.2 22.38,9.02 22.38,8.45 22.43,8.4 | 21.66,13.51 U3.25 24.49,13.5 24.78,13.79 v25.24,13.79 | C18.2 10.8,8.59 10.57,8.82 | C3.2 9.45,4.14 9.45,4.47 | 20.27,9.29 20.41,9.29 U3.37 20.41,12.71 | 20.27,9.29 19.91,9.29 C13.2 | 22.43,8.4 22.86,7.98 22.86,6.63 22.62,6.4 22.41,6.4 C9.2 22.38,5.74 v22.33,5.69 | 18.04,17.14 17.52,17.66 v17.52,18.69 | 15.62,10.87 15.62,10.46 v15.65,10.44 | 20.27,9.29 21.15,8.4 22.43,8.4 | v20.36,4.98 20.26,5.08 19.91,5.08 | 19.89,5.08 19.91,5.08 | 14.55,3.79 14.63,3.86 C15.2 15.84,4.68 16.04,4.48 X1.2 16.05,4.57 16.2,4.57 17.26,5.63 X1.4 17.41,6.67 C14.2 17.45,6.72 17.45,7.21 18.31,7.21 18.31,6.67 18.78,6.2 C10.2 19.36,5.82 19.36,5.64 19.91,5.08
  Bottom 0.203: U$3.P3 5.61,14.07 11.46,19.91 | 21.66,13.51 U3.41 20.41,12.71
  Bottom 0.254: U$3.P3 7.16,13.34 11.57,8.93
  Bottom 0.813: C7.2 6.83,13.45 5.61,13.45
XC1  (via drill 0.35)
  Top 0.152: v19.7,4.44 19.7,6.14 19.83,6.27 23.08,6.27 23.82,7.01 23.82,8.23 v24.33,8.74 | v18.92,3.68 16.25,3.68 16,3.93 v16,6.51
  Bottom 0.152: v24.33,8.74 24.07,8.74 24.07,10.05 24.52,10.5 24.52,12.06 24.29,12.29 23.53,12.29 U3.28 | C15.1 15.09,5.63 X1.3 16,5.67 v16,6.51 | v19.7,4.44 19.68,4.44 v18.92,3.68
XC2  (via drill 0.35)
  Top 0.152: v23.54,9.67 23.46,9.59 23.46,7.17 22.96,6.67 19.13,6.67 19.13,5.42 19.07,5.36 v19.07,5.14
  Bottom 0.152: U3.29 24.14,11.92 24.14,10.65 23.54,10.05 v23.54,9.67 | 18.29,5.13 18.29,4.6 18.03,4.34 17.55,4.34 X1.1 | 18.29,5.13 18.27,5.13 18.27,6.15 17.9,6.51 C14.1 | 18.29,5.13 19.08,5.13 19.08,5.24 19.07,5.23 v19.07,5.14